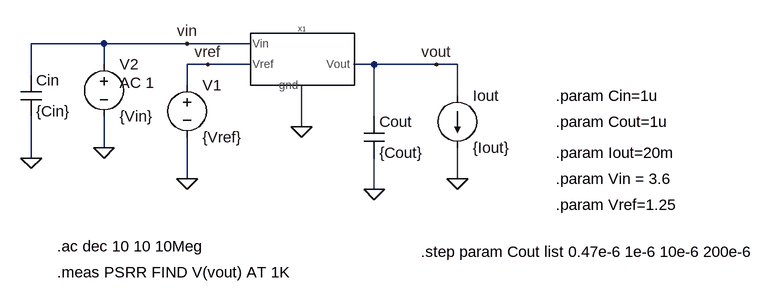
[diagram p0: schematic PSRR_6p36.asc]
PSRR_6p36.asc, the LTspice schematic file:
Version 4
SHEET 1 956 680
WIRE -96 80 -208 80
WIRE 32 80 -96 80
WIRE 128 80 32 80
WIRE -96 112 -96 80
WIRE 64 112 32 112
WIRE 128 112 64 112
WIRE 320 112 288 112
WIRE 416 112 320 112
WIRE 448 112 416 112
WIRE -208 128 -208 80
WIRE 32 144 32 112
WIRE 448 160 448 112
WIRE 320 192 320 112
WIRE 208 208 208 144
WIRE -96 240 -96 192
WIRE -208 256 -208 192
WIRE 32 288 32 224
WIRE 448 288 448 240
WIRE 320 304 320 256
FLAG 64 112 vref
FLAG -96 240 0
FLAG 32 80 vin
FLAG 320 304 0
FLAG 448 288 0
FLAG 416 112 vout
FLAG 208 208 0
FLAG -208 256 0
FLAG 32 288 0
SYMBOL LDO_basic 208 96 R0
SYMATTR InstName X1
SYMBOL voltage 32 128 R0
WINDOW 123 0 0 Left 0
WINDOW 39 0 0 Left 0
SYMATTR InstName V1
SYMATTR Value {Vref}
SYMBOL voltage -96 96 R0
WINDOW 123 24 44 Left 2
WINDOW 39 0 0 Left 0
SYMATTR Value2 AC 1
SYMATTR InstName V2
SYMATTR Value {Vin}
SYMBOL cap 304 192 R0
SYMATTR InstName Cout
SYMATTR Value {Cout}
SYMBOL current 448 160 R0
WINDOW 123 0 0 Left 0
WINDOW 39 0 0 Left 0
SYMATTR InstName Iout
SYMATTR Value {Iout}
SYMBOL cap -224 128 R0
SYMATTR InstName Cin
SYMATTR Value {Cin}
TEXT -168 392 Left 2 !.ac dec 10 10 10Meg
TEXT 600 248 Left 2 !.param Iout=20m
TEXT 600 200 Left 2 !.param Cout=1u
TEXT 600 160 Left 2 !.param Cin=1u
TEXT 600 288 Left 2 !.param Vin = 3.6
TEXT 600 328 Left 2 !.param Vref=1.25
TEXT 392 400 Left 2 !.step param Cout list 0.47e-6 1e-6 10e-6 200e-6
TEXT -168 432 Left 2 !.meas PSRR FIND V(vout) AT 1K

The netlist it stands for:
* PSRR_6p36.asc
XX1 vin vref 0 vout LDO_basic  ; pins Vin Vref gnd Vout
V1 vref 0 {Vref}
V2 vin 0 {Vin} AC 1
Cout vout 0 {Cout}
Iout vout 0 {Iout}
Cin vin 0 {Cin}
.ac dec 10 10 10Meg
.param Iout=20m
.param Cout=1u
.param Cin=1u
.param Vin = 3.6
.param Vref=1.25
.step param Cout list 0.47e-6 1e-6 10e-6 200e-6
.meas PSRR FIND V(vout) AT 1K
.backanno
.end